# EAGLE board DeMuxRow2 (EAGLE 6.6.0)
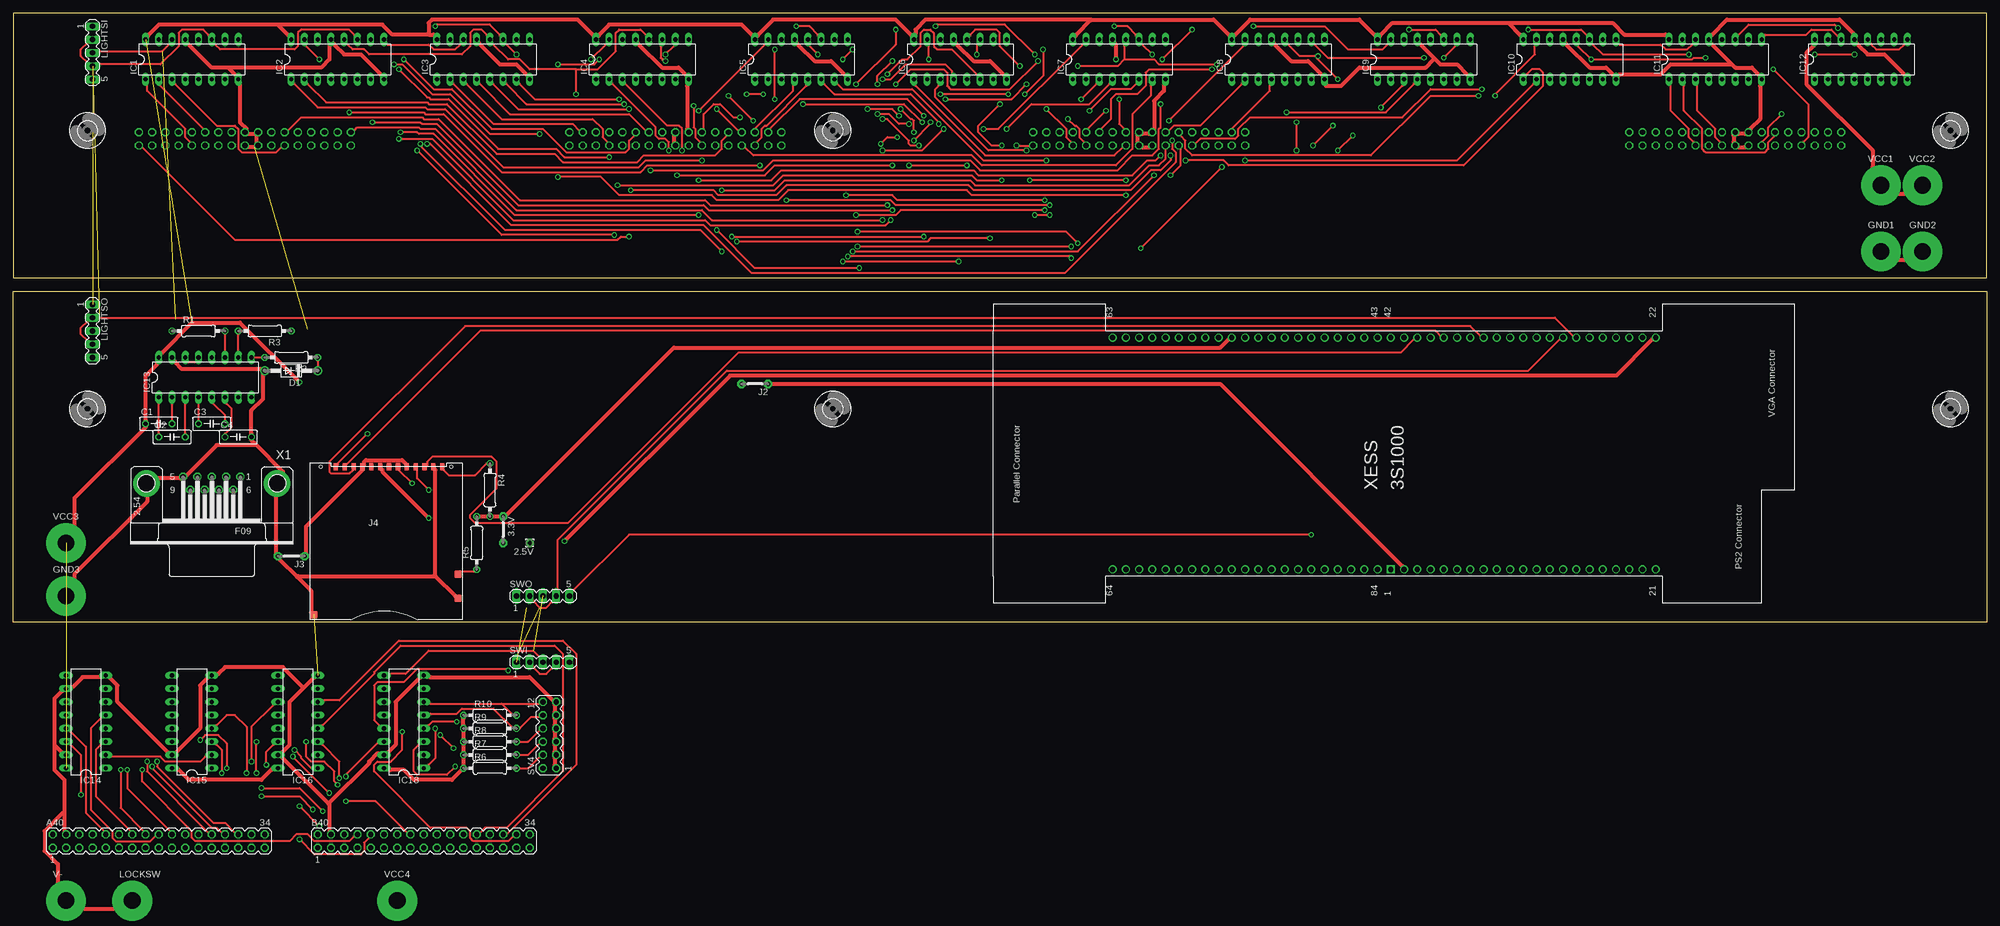
[diagram p2: board, top side]
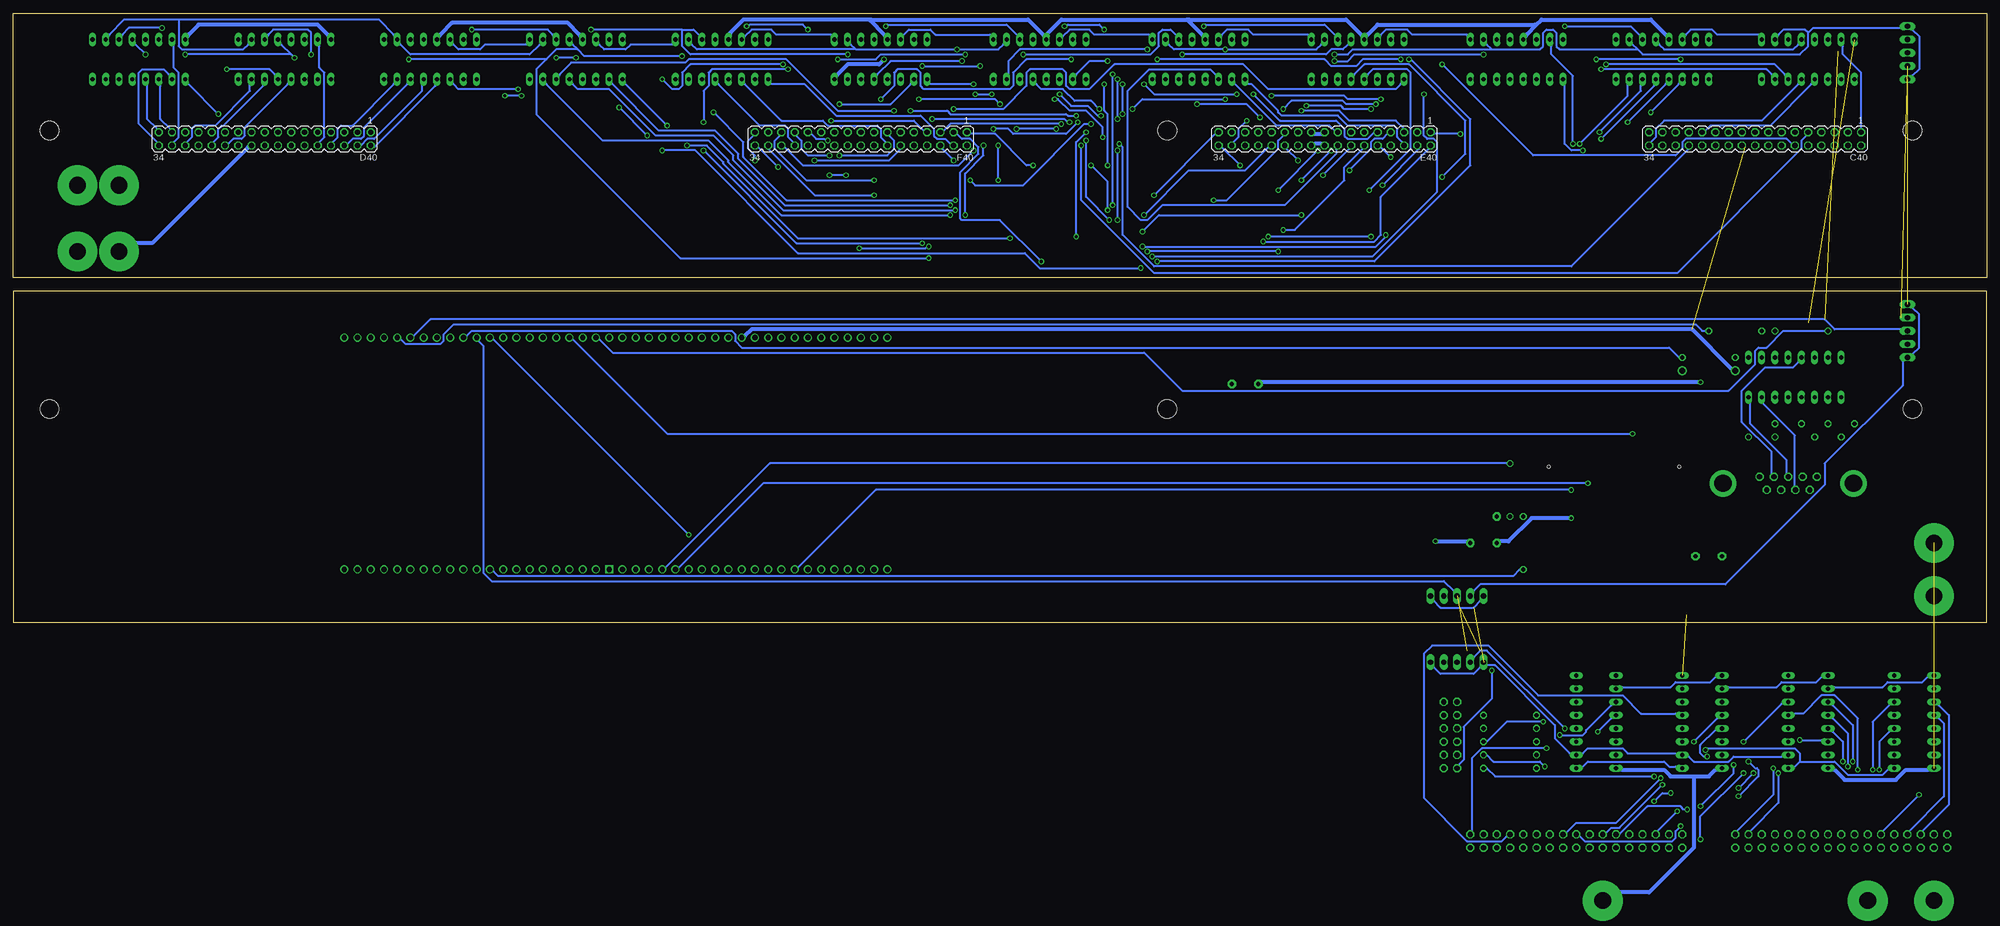
[diagram p3: board, bottom side, seen from below]

Size 378.46 x 116.84 mm. Coordinates in mm from the lower left corner, seen from the top.
Outline: 378.46,66.04 378.46,116.84 0,116.84 0,66.04 378.46,66.04
Outline: 0,63.5 378.46,63.5 378.46,0 0,0 0,63.5
Copper layers (1*16): Top 0.035mm / dielectric 1.5mm / Bottom 0.035mm
Design rules "15mils": minimum track width 15mil, minimum drill 24mil, track to track 15mil, track to pad 10mil, pad to pad 10mil, via to via 10mil, smd to smd 10mil, copper to edge 25mil, drill to drill 10mil, minimum pad ring 10mil, minimum via ring 8mil, stop-mask expansion 0mil, vias tented up to drill 0mil, thermal gap 10mil
Net classes: 1 supply: width 0.762 mm

## Footprints (pad centres in the part's own frame; a part is rotated, then mirrored left to right if it is on the bottom)
1,6/0,8 = drill 0.813 pad 1.6 octagon: 1 0,0
05 = drill 0.813 pad 1.6 octagon: 1 -2.54,0; 2 2.54,0
MA17-2 = drill 1.016 octagon: 1 -20.32,-1.27; 2 -20.32,1.27; 3 -17.78,-1.27; 4 -17.78,1.27; 5 -15.24,-1.27; 6 -15.24,1.27; 7 -12.7,-1.27; 8 -12.7,1.27; 9 -10.16,-1.27; 10 -10.16,1.27; 11 -7.62,-1.27; 12 -7.62,1.27; 13 -5.08,-1.27; 14 -5.08,1.27; 15 -2.54,-1.27; 16 -2.54,1.27; 17 0,-1.27; 18 0,1.27; 19 2.54,-1.27; 20 2.54,1.27; 21 5.08,-1.27; 22 5.08,1.27; 23 7.62,-1.27; 24 7.62,1.27; 25 10.16,-1.27; 26 10.16,1.27; 27 12.7,-1.27; 28 12.7,1.27; 29 15.24,-1.27; 30 15.24,1.27; 31 17.78,-1.27; 32 17.78,1.27; 33 20.32,-1.27; 34 20.32,1.27
C050-025X075 = drill 0.813 octagon: 1 -2.54,0; 2 2.54,0
DO41Z10 = drill 1.118: A 5.08,0; C -5.08,0
SPADELUG = drill 3.175 pad 7.62: 1 0,0
DIL16 = drill 0.813 long: 1 -8.89,-3.81; 2 -6.35,-3.81; 3 -3.81,-3.81; 4 -1.27,-3.81; 5 1.27,-3.81; 6 3.81,-3.81; 7 6.35,-3.81; 8 8.89,-3.81; 9 8.89,3.81; 10 6.35,3.81; 11 3.81,3.81; 12 1.27,3.81; 13 -1.27,3.81; 14 -3.81,3.81; 15 -6.35,3.81; 16 -8.89,3.81
SCDA5A = smd 1 x 1.3: 1 -7.525,-0.65; 2 -5.825,-0.65; 3 -4.125,-0.65; 3A -2.425,-0.65; 4 -0.725,-0.65; 4A 0.975,-0.65; 5 2.675,-0.65; 6 4.375,-0.65; 7 6.075,-0.65; 8 7.775,-0.65; 9 -9.225,-0.65; 10 11.175,-0.65; 11 9.475,-0.65 | smd 1.4 x 1.4: 12 14.2,-21.225; 13 14.2,-25.875; 14 -13.475,-28.975 | hole 0.61: 12.875,-0.6; -12.125,-0.6
MA05-1 = drill 1.016 long: 1 -5.08,0; 2 -2.54,0; 3 0,0; 4 2.54,0; 5 5.08,0
0207/10 = drill 0.813 octagon: 1 -5.08,0; 2 5.08,0
MA06-2 = drill 1.016 octagon: 1 -6.35,-1.27; 2 -6.35,1.27; 3 -3.81,-1.27; 4 -3.81,1.27; 5 -1.27,-1.27; 6 -1.27,1.27; 7 1.27,-1.27; 8 1.27,1.27; 9 3.81,-1.27; 10 3.81,1.27; 11 6.35,-1.27; 12 6.35,1.27
3,6 = hole 3.6: 0,0
F09HP = drill 1.016 octagon: 1 -5.486,-1.27; 2 -2.743,-1.27; 3 0,-1.27; 4 2.743,-1.27; 5 5.486,-1.27; 6 -4.115,1.27; 7 -1.372,1.27; 8 1.372,1.27; 9 4.115,1.27 | drill 3.302 pad 5.08: G1 -12.522,0; G2 12.522,0
3S1000 = drill 1.016 square: 1 0,0 | drill 1.016: 2 0,-2.54; 3 0,-5.08; 4 0,-7.62; 5 0,-10.16; 6 0,-12.7; 7 0,-15.24; 8 0,-17.78; 9 0,-20.32; 10 0,-22.86; 11 0,-25.4; 12 0,-27.94; 13 0,-30.48; 14 0,-33.02; 15 0,-35.56; 16 0,-38.1; 17 0,-40.64; 18 0,-43.18; 19 0,-45.72; 20 0,-48.26; 21 0,-50.8; 22 44.45,-50.8; 23 44.45,-48.26; 24 44.45,-45.72; 25 44.45,-43.18; 26 44.45,-40.64; 27 44.45,-38.1; 28 44.45,-35.56; 29 44.45,-33.02; 30 44.45,-30.48; 31 44.45,-27.94; 32 44.45,-25.4; 33 44.45,-22.86; 34 44.45,-20.32; 35 44.45,-17.78; 36 44.45,-15.24; 37 44.45,-12.7; 38 44.45,-10.16; 39 44.45,-7.62; 40 44.45,-5.08; 41 44.45,-2.54; 42 44.45,0; 43 44.45,2.54; 44 44.45,5.08; 45 44.45,7.62; 46 44.45,10.16; 47 44.45,12.7; 48 44.45,15.24; 49 44.45,17.78; 50 44.45,20.32; 51 44.45,22.86; 52 44.45,25.4; 53 44.45,27.94; 54 44.45,30.48; 55 44.45,33.02; 56 44.45,35.56; 57 44.45,38.1; 58 44.45,40.64; 59 44.45,43.18; 60 44.45,45.72; 61 44.45,48.26; 62 44.45,50.8; 63 44.45,53.34; 64 0,53.34; 65 0,50.8; 66 0,48.26; 67 0,45.72; 68 0,43.18; 69 0,40.64; 70 0,38.1; 71 0,35.56; 72 0,33.02; 73 0,30.48; 74 0,27.94; 75 0,25.4; 76 0,22.86; 77 0,20.32; 78 0,17.78; 79 0,15.24; 80 0,12.7; 81 0,10.16; 82 0,7.62; 83 0,5.08; 84 0,2.54

## Placement (x,y rotation side)
2.5V  [1,6/0,8]  99.06,15.24 180 top
3.3V  J5MM  [05]  93.98,17.78 270 top
A40  [MA17-2]  27.94,-41.91 0 top  (outside the outline)
B40  [MA17-2]  78.74,-41.91 0 top  (outside the outline)
C1  0.1uf  [C050-025X075]  27.94,38.1 0 top
C2  0.1uf  [C050-025X075]  30.48,35.56 0 top
C3  0.1uf  [C050-025X075]  38.1,38.1 0 top
C4  0.1uf  [C050-025X075]  43.18,35.56 0 top
C40  [MA17-2]  44.45,92.71 180 bottom
D1  1N4728  [DO41Z10]  53.34,48.26 180 top
D40  [MA17-2]  330.2,92.71 180 bottom
E40  [MA17-2]  127,92.71 180 bottom
F40  [MA17-2]  215.9,92.71 180 bottom
GND1  LUG  [SPADELUG]  358.14,71.12 0 top
GND2  LUG  [SPADELUG]  366.08,71.12 0 top
GND3  LUG  [SPADELUG]  10.16,5.08 0 top
IC1  74HC595N  [DIL16]  34.29,107.95 0 top
IC2  74HC595N  [DIL16]  62.23,107.95 0 top
IC3  74HC595N  [DIL16]  90.17,107.95 0 top
IC4  74HC595N  [DIL16]  120.65,107.95 0 top
IC5  74HC595N  [DIL16]  151.13,107.95 0 top
IC6  74HC595N  [DIL16]  181.61,107.95 0 top
IC7  74HC595N  [DIL16]  212.09,107.95 0 top
IC8  74HC595N  [DIL16]  242.57,107.95 0 top
IC9  74HC595N  [DIL16]  270.51,107.95 0 top
IC10  74HC595N  [DIL16]  298.45,107.95 0 top
IC11  74HC595N  [DIL16]  326.39,107.95 0 top
IC12  74HC595N  [DIL16]  354.33,107.95 0 top
IC13  MAX232  [DIL16]  36.83,46.99 0 top
IC14  74HC165N  [DIL16]  13.97,-19.05 90 top  (outside the outline)
IC15  74HC165N  [DIL16]  34.29,-19.05 90 top  (outside the outline)
IC16  74HC165N  [DIL16]  54.61,-19.05 90 top  (outside the outline)
IC18  74HC165N  [DIL16]  74.93,-19.05 90 top  (outside the outline)
J2  J5MM  [05]  142.24,45.72 180 top
J3  J5MM  [05]  53.34,12.7 180 top
J4  SDCARD  [SCDA5A]  71.12,30.48 0 top
LIGHTSI  [MA05-1]  15.24,109.22 270 top
LIGHTSO  [MA05-1]  15.24,55.88 270 top
LOCKSW  LUG  [SPADELUG]  22.86,-53.34 0 top  (outside the outline)
R1  330  [0207/10]  35.56,55.88 0 top
R2  330  [0207/10]  53.34,50.8 180 top
R3  330  [0207/10]  48.26,55.88 180 top
R4  330  [0207/10]  91.44,25.4 270 top
R5  330  [0207/10]  88.9,15.24 90 top
R6  330  [0207/10]  91.44,-27.94 0 top  (outside the outline)
R7  330  [0207/10]  91.44,-25.4 0 top  (outside the outline)
R8  330  [0207/10]  91.44,-22.86 0 top  (outside the outline)
R9  330  [0207/10]  91.44,-20.32 0 top  (outside the outline)
R10  330  [0207/10]  91.44,-17.78 0 top  (outside the outline)
SV4  [MA06-2]  102.87,-21.59 90 top  (outside the outline)
SWI  [MA05-1]  101.6,-7.62 0 top  (outside the outline)
SWO  [MA05-1]  101.6,5.08 0 top
U$1  [3,6]  14.29,40.96 0 top
U$2  [3,6]  157.16,40.96 0 top
U$3  [3,6]  371.48,40.96 0 top
U$5  [3,6]  371.48,94.3 0 top
U$9  [3,6]  14.29,94.3 0 top
U$11  [3,6]  157.16,94.3 0 top
V-  LUG  [SPADELUG]  10.16,-53.34 0 top  (outside the outline)
VCC1  LUG  [SPADELUG]  358.14,83.82 0 top
VCC2  LUG  [SPADELUG]  366.08,83.82 0 top
VCC3  LUG  [SPADELUG]  10.16,15.24 0 top
VCC4  LUG  [SPADELUG]  73.66,-53.34 0 top  (outside the outline)
X1  [F09HP]  38.1,26.67 180 top
XESS  3S1000  [3S1000]  264.16,10.16 90 top

## Tracks (layer width: path | path; a pad name or v marks a point on that pad's centre or on a via)
+2V5  (via drill 0.61)
  Top 0.762: v105.73,15.56 137.48,47.31 307.34,47.31 314.32,54.29 XESS.22
  Bottom 0.762: v105.73,15.56 99.69,15.56 2.5V.1
+3V3
  Top 0.762: XESS.54 233.04,54.29 231.46,52.71 126.68,52.71 94.61,20.64 3.3V.1 93.34,20.32 92.08,20.32 R4.2 90.81,20.32 89.53,20.32 R5.2
+5V
  Top 0.762: XESS.2 266.38,10.8 231.46,45.72 145.41,45.72 J2.1
AC0  (via drill 0.61)
  Top 0.381: v220.03,99.38 220.03,94.93 219.71,94.62 219.71,90.81 218.44,89.54 214.63,89.54 211.77,86.68 185.42,86.68 183.51,88.58 145.73,88.58 143.83,86.68 v122.24,86.68
  Bottom 0.381: v220.03,99.38 210.19,99.38 206.38,103.19 IC7.2 | v122.24,86.68 118.11,90.81 118.11,92.08 117.47,92.71 115.89,92.71 114.94,93.66 E40.7
AC1  (via drill 0.61)
  Top 0.381: v204.79,100.33 207.65,103.19 IC7.3 | v189.23,99.38 185.1,95.25 185.1,93.98 187.64,91.44 v189.55,91.44 | v189.55,84.77 184.78,84.77 183.83,85.73 147.64,85.73 145.73,83.82 v115.89,83.82
  Bottom 0.381: v204.79,100.33 190.18,100.33 v189.23,99.38 | v189.55,84.77 v189.55,91.44 | v115.89,83.82 108.9,90.81 E40.4
AC2  (via drill 0.61)
  Top 0.381: v190.5,94.62 195.26,99.38 206.38,99.38 210.19,103.19 IC7.4 | v174.31,95.89 170.81,99.38 v151.45,99.38 | v139.38,96.84 138.11,96.84 135.57,99.38 134.3,99.38 132.4,97.47 132.4,94.62 E40.21
  Bottom 0.381: v190.5,94.62 187.64,94.62 186.69,93.66 176.53,93.66 v174.31,95.89 | v151.45,99.38 141.92,99.38 v139.38,96.84
AC3  (via drill 0.61)
  Top 0.381: v196.53,107.63 191.13,102.24 179.71,102.24 179.07,102.87 179.07,105.41 178.44,106.05 172.09,106.05 v169.23,103.19 | v168.59,87.63 146.05,87.63 144.15,85.73 v127.32,85.73
  Bottom 0.381: v196.53,107.63 210.19,107.63 212.72,105.09 IC7.5 | v169.23,103.19 169.23,98.11 168.59,97.47 v168.59,87.63 | v127.32,85.73 122.24,90.81 E40.14
AC4  (via drill 0.61)
  Top 0.381: v206.38,98.11 210.5,102.24 214.31,102.24 215.26,103.19 IC7.6 | v174.62,97.16 171.45,100.33 150.81,100.33 145.1,94.62 E40.31
  Bottom 0.381: v206.38,98.11 199.39,98.11 198.75,97.47 176.53,97.47 176.21,97.16 v174.62,97.16
AC5
  Top 0.381: IC7.7 218.12,102.87 218.12,100.97 214.63,97.47 214.63,90.81 211.46,87.63 185.74,87.63 183.83,89.54 141.92,89.54 140.34,91.12 E40.28
AC6  (via drill 0.61)
  Top 0.381: v221.62,96.2 235.9,110.49 IC8.15
  Bottom 0.381: v221.62,96.2 205.74,96.2 203.84,94.3 F40.7
AC7
  Bottom 0.381: IC8.1 233.04,103.19 226.69,103.19 220.66,97.16 204.47,97.16 201.93,94.62 201.93,93.34 201.29,92.71 199.71,92.71 198.75,91.76 F40.4
AC8
  Top 0.381: IC8.2 235.59,103.19 227.65,95.25 222.57,95.25 221.62,94.3 F40.21
AC9
  Bottom 0.381: IC8.3 238.12,103.19 231.14,96.2 223.2,96.2 222.25,95.25 212.72,95.25 212.09,94.62 212.09,93.03 211.14,92.08 F40.14
AC10
  Top 0.381: IC8.4 240.98,102.87 240.98,101.92 233.68,94.62 F40.31
AC11
  Bottom 0.381: IC8.5 243.21,103.19 235.27,95.25 230.5,95.25 229.87,94.62 229.87,93.03 228.92,92.08 F40.28
AND
  Bottom 0.381: IC10.4 297.5,102.87 309.25,91.12 D40.2
BREAK  (via drill 0.61)
  Top 0.381: v339.09,97.47 336.55,94.93 336.55,93.34 335.28,92.08 D40.22
  Bottom 0.381: v339.09,97.47 344.81,103.19 IC12.1
CA
  Bottom 0.381: IC12.15 347.66,110.49 347.66,106.36 346.71,105.41 346.71,93.03 347.66,92.08 D40.32
CF1  (via drill 0.61)
  Top 0.381: v94.93,-9.21 94.61,-8.89 77.47,-8.89 74.93,-11.43 69.85,-11.43 69.22,-12.06 69.22,-18.73 70.17,-19.68 IC18.13
  Bottom 0.381: v94.93,-9.21 94.93,-14.6 100.33,-20 100.33,-26.35 101.28,-27.3 SV4.2
CF2  (via drill 0.61)
  Top 0.381: R6.2 97.16,-27.94 98.74,-27.94 100.97,-25.72 SV4.4 | v63.82,-29.53 63.82,-29.21 69.85,-23.18 IC18.14
  Bottom 0.381: v63.82,-29.53 94.3,-29.53 95.89,-27.94 R6.2
CF3  (via drill 0.61)
  Top 0.381: R7.2 97.16,-25.4 98.74,-25.4 100.97,-23.18 SV4.6 | v84.77,-27.62 83.19,-29.21 77.47,-29.21 76.83,-28.57 76.83,-24.45 77.79,-23.49 IC18.3
  Bottom 0.381: v84.77,-27.62 85.72,-26.67 94.61,-26.67 95.89,-25.4 R7.2
CF4  (via drill 0.61)
  Top 0.381: R8.2 97.16,-22.86 98.74,-22.86 100.97,-20.64 SV4.8 | v85.09,-19.05 80.33,-19.05 79.69,-19.68 IC18.4
  Bottom 0.381: v85.09,-19.05 92.08,-19.05 95.89,-22.86 R8.2
CF5
  Top 0.381: IC18.5 80.01,-17.46 85.09,-17.46 86.04,-16.51 92.08,-16.51 95.89,-20.32 R9.2 97.16,-20.32 99.38,-18.1 100.97,-18.1 SV4.10
CF6
  Top 0.381: 93.66,-15.56 80.01,-15.56 IC18.6 | 93.66,-15.56 95.89,-17.78 R10.2 | 93.66,-15.56 100.97,-15.56 SV4.12
CONT
  Bottom 0.381: IC16.5 59.69,-17.46 66.36,-17.46 69.85,-13.97 86.04,-13.97 95.57,-4.44 106.36,-4.44 107.95,-6.03 107.95,-33.65 99.69,-41.91 93.03,-41.91 92.08,-40.96 B40.28
DCA
  Bottom 0.381: IC10.7 305.44,103.19 313.37,95.25 315.6,95.25 316.23,94.62 316.23,93.03 317.18,92.08 D40.8
DEFER
  Bottom 0.381: IC11.6 330.52,102.87 338.14,95.25 338.45,95.25 339.09,94.62 339.09,93.03 340.04,92.08 D40.26
DEP  (via drill 0.61)
  Top 0.381: v62.55,-29.84 62.55,-26.67 59.37,-23.49 IC16.3
  Bottom 0.381: v62.55,-29.84 71.12,-38.42 78.74,-38.42 80.64,-40.32 B40.20
DF0
  Bottom 0.381: IC1.15 27.62,110.49 27.62,108.9 24.13,105.41 24.13,94.62 C40.1
DF1
  Top 0.381: IC1.1 25.72,102.87 25.72,101.92 33.02,94.62 33.02,93.03 33.97,92.08 C40.10
DF2
  Top 0.381: IC1.2 28.26,102.87 36.51,94.62 C40.11
EXAM
  Top 0.381: IC16.4 59.37,-19.68 69.22,-9.84 69.22,-9.52 74.3,-4.44 103.82,-4.44 105.41,-6.03 105.41,-28.57 94.61,-39.37 90.49,-39.37 89.53,-40.32 B40.26
EXECUTE  (via drill 0.61)
  Top 0.381: v337.5,106.05 344.17,99.38 344.17,93.03 343.22,92.08 D40.28
  Bottom 0.381: v337.5,106.05 329.25,106.05 328.3,105.09 IC11.5
FETCH
  Bottom 0.381: IC11.4 325.75,103.19 334.01,94.93 334.01,93.34 334.64,92.71 336.23,92.71 337.19,91.76 D40.24
GND  (via drill 0.61)  (2 unrouted)
  Top 0.762: GND1.1 361.63,69.53 362.58,69.53 GND2.1 | IC10.13 297.81,110.81 302.26,106.36 305.44,106.36 306.7,105.09 IC10.8 307.98,105.09 315.91,105.09 317.82,107 329.25,107 329.41,107.16 | IC12.8 362.58,105.09 358.77,108.9 355.6,108.9 353.69,110.81 IC12.13 352.74,113.03 350.2,115.57 328.61,115.57 325.75,112.71 IC11.13 325.75,110.81 329.41,107.16 | D40.20 332.11,91.12 330.83,91.12 D40.18 329.88,92.08 329.88,93.34 D40.17 330.83,93.66 332.11,93.66 D40.19 333.06,94.62 334.96,96.52 334.96,102.87 IC11.8 334.64,105.09 333.38,106.36 330.2,106.36 329.41,107.16 | E40.17 126.68,93.34 126.68,92.08 E40.18 | E40.19 129.22,94.62 129.22,102.87 IC4.8 128.91,105.09 127.64,106.36 124.46,106.36 120.02,110.81 IC4.13 | IC3.8 98.42,105.09 96.52,107 93.34,107 89.53,110.81 IC3.13 | IC2.8 70.48,105.09 66.67,108.9 63.5,108.9 61.59,110.81 IC2.13 60.64,110.49 60.64,107.95 59.05,106.36 41.59,106.36 41.27,106.36 | C40.18 45.09,91.12 46.35,91.12 C40.20 46.67,92.08 46.67,93.34 C40.19 46.35,93.66 45.09,93.66 C40.17 44.77,94.62 43.5,95.89 43.5,102.87 IC1.8 42.55,105.09 41.27,106.36 | 41.27,106.36 38.1,106.36 33.66,110.81 IC1.13 | IC5.8 159.38,105.09 156.84,107.63 153.67,107.63 150.5,110.81 IC5.13 | IC6.8 189.87,105.09 187.32,107.63 184.15,107.63 180.97,110.81 IC6.13 | F40.20 217.81,91.12 216.53,91.12 F40.18 215.58,92.08 215.58,93.34 F40.17 216.53,93.66 217.81,93.66 F40.19 218.76,94.62 218.76,100.01 220.66,101.92 220.66,102.87 IC7.8 | 272.57,108.11 269.88,110.81 IC9.13 | 272.57,108.11 273.69,107 276.86,107 278.76,105.09 IC9.8 | IC8.13 241.94,110.81 245.11,107.63 248.28,107.63 250.82,105.09 IC8.8 251.78,102.87 254.63,102.87 258.13,106.36 270.83,106.36 272.42,107.95 272.57,108.11
  Top 0.762: v211.46,107.95 211.46,110.81 IC7.13 | 46.51,34.13 51.75,28.89 X1.G1 50.48,24.45 50.48,13.34 J3.2 51.12,12.07 54.45,8.73 | 46.51,34.13 45.72,34.93 C4.2 45.72,36.2 45.72,40.64 47.94,42.86 47.94,47.63 D1.A 47.62,48.58 32.38,48.58 31.11,49.85 IC13.15 | 46.51,34.13 46.35,33.97 39.05,33.97 33.34,28.26 X1.5 32.07,27.62 27.94,27.62 X1.G2 25.72,23.18 11.75,9.21 11.75,8.57 GND3.1 | 80.96,8.89 80.96,29.21 J4.11 | 80.96,8.89 84.77,5.08 J4.13 | 54.45,8.73 57.15,6.03 57.15,1.91 J4.14 | 80.96,8.89 80.64,8.89 54.61,8.89 54.45,8.73 | 60.48,-34.77 60.64,-34.92 60.64,-40 B40.4 | 60.48,-34.77 51.75,-26.03 IC16.15 51.75,-24.77 53.02,-23.49 53.02,-15.24 55.72,-12.54 | 55.72,-12.54 57.47,-10.79 IC16.8 | SV4.1 103.82,-27.3 103.82,-26.03 SV4.3 103.82,-24.77 103.82,-23.49 SV4.5 103.82,-22.22 103.82,-20.95 SV4.7 103.82,-19.68 103.82,-18.41 SV4.9 103.82,-17.14 103.82,-15.88 SV4.11 103.5,-14.92 99.06,-10.48 80.01,-10.48 IC18.8 77.79,-10.79 73.34,-15.24 73.34,-23.49 72.07,-24.77 IC18.15 69.85,-25.08 68.26,-26.67 68.26,-26.99 60.64,-34.61 60.48,-34.77 | LOCKSW.1 19.37,-54.93 13.65,-54.93 V-.1 8.57,-49.85 8.57,-46.35 6.03,-43.81 6.03,-40 9.53,-36.51 9.84,-36.51 | 8.1,-23.65 7.94,-23.49 7.94,-14.6 9.21,-13.33 IC14.10 11.43,-12.38 13.34,-10.48 16.51,-10.48 IC14.8 18.73,-10.79 20,-12.06 20,-15.24 29.53,-24.77 IC15.15 31.43,-24.77 35.88,-20.32 35.88,-12.06 37.15,-10.79 IC15.8 39.37,-9.84 40.64,-8.57 51.75,-8.57 55.56,-12.38 55.72,-12.54 | 8.1,-23.65 9.21,-24.77 IC14.15 | 9.84,-36.51 9.84,-30.16 7.94,-28.26 7.94,-23.81 8.1,-23.65 | 9.84,-36.51 9.84,-40 A40.4
  Bottom 0.762: GND1.1 354.65,72.71 351.79,72.71 333.38,91.12 D40.20 | E40.18 127.64,91.76 128.91,91.76 E40.20 | E40.17 127.64,93.66 128.91,93.66 E40.19 | 86.52,114.46 85.41,115.57 64.45,115.57 61.59,112.71 IC2.13 | 86.52,114.46 88.27,112.71 IC3.13 | 86.52,114.46 86.68,114.62 116.84,114.62 118.75,112.71 IC4.13 120.02,112.71 122.87,115.57 153.03,115.57 153.19,115.41 | 153.19,115.41 153.35,115.57 177.48,115.57 180.02,113.03 IC6.13 180.97,112.71 183.83,115.57 214,115.57 214.15,115.41 | 153.19,115.41 150.5,112.71 IC5.13 | 214.15,115.41 214.31,115.57 238.44,115.57 240.98,113.03 IC8.13 | 214.15,115.41 211.46,112.71 IC7.13 | v211.46,107.95 212.41,107 218.44,107 220.34,105.09 IC7.8 | IC10.13 296.55,112.71 294.32,114.94 272.1,114.94 269.88,112.71 IC9.13 | XESS.52 238.12,54.93 236.85,56.2 56.52,56.2 48.9,48.58 D1.A
IF0
  Top 0.381: IC1.3 31.11,103.19 39.05,95.25 42.55,95.25 43.18,94.62 43.18,90.81 43.81,90.17 50.48,90.17 51.44,91.12 C40.24
IF1
  Bottom 0.381: IC1.4 33.66,103.19 41.59,95.25 53.02,95.25 53.98,94.3 C40.25
IF2
  Bottom 0.381: IC1.5 36.2,103.19 43.18,96.2 61.91,96.2 63.5,94.62 63.5,93.03 64.45,92.08 C40.34
ION
  Bottom 0.381: IC12.2 348.62,105.09 349.57,106.05 353.69,106.05 354.33,105.41 354.33,95.57 350.84,92.08 D40.34
IOT
  Top 0.381: IC11.2 320.36,102.87 320.36,98.11 323.85,94.62 323.85,90.81 324.49,90.17 335.92,90.17 336.55,90.81 336.55,92.08 337.82,93.34 D40.23
ISZ
  Bottom 0.381: IC10.6 302.89,103.19 311.15,94.93 311.15,93.34 311.79,92.71 313.37,92.71 314.32,91.76 D40.6
JMP
  Top 0.381: IC11.1 317.82,102.87 317.82,98.11 321.31,94.62 321.31,93.03 322.26,92.08 D40.12
JMS
  Bottom 0.381: IC11.15 319.72,110.49 319.72,106.36 318.77,105.41 318.77,93.03 319.72,92.08 D40.10
LA  (via drill 0.61)
  Top 0.381: v48.58,-27.3 48.58,-24.77 49.85,-23.49 IC16.14 | v58.74,-39.05 v54.93,-35.24
  Bottom 0.381: v48.58,-27.3 48.58,-28.89 v54.93,-35.24 | v58.74,-39.05 59.69,-40 59.69,-41.27 60.33,-41.91 77.15,-41.91 78.11,-40.96 B40.18
LINK  (via drill 0.61)
  Top 0.381: v194.31,103.19 191.45,100.33 v178.75,100.33 | v169.54,93.03 167.64,93.03 v166.37,91.76
  Bottom 0.381: v194.31,103.19 202.56,103.19 IC7.1 | v178.75,100.33 178.12,100.33 175.9,98.11 172.72,98.11 169.54,94.93 v169.54,93.03 | v166.37,91.76 165.74,91.12 165.74,74.3 159.7,68.26 79.69,68.26 57.15,90.81 C40.28
MA0
  Top 0.381: IC3.2 84.45,103.19 92.08,95.57 107.31,95.57 108.58,94.3 E40.3
MA1
  Top 0.381: IC3.3 87,103.19 93.66,96.52 111.12,96.52 113.03,94.62 113.03,93.03 113.98,92.08 E40.8
MA2
  Top 0.381: IC3.4 89.53,103.19 95.25,97.47 118.11,97.47 121.28,94.3 E40.13
MA3  (via drill 0.61)
  Top 0.381: v118.11,98.43 96.84,98.43 92.08,103.19 IC3.5 | v130.49,99.06 130.49,94.93 130.81,94.62 130.81,93.03 131.76,92.08 E40.22
  Bottom 0.381: v118.11,98.43 123.19,98.43 123.83,99.06 v130.49,99.06
MA4  (via drill 0.61)
  Top 0.381: v117.16,99.38 98.42,99.38 94.61,103.19 IC3.6 | v134.94,98.43 139.06,94.3 E40.27
  Bottom 0.381: v117.16,99.38 122.87,99.38 123.51,100.01 133.35,100.01 v134.94,98.43
MA5  (via drill 0.61)
  Top 0.381: v116.2,100.33 100.01,100.33 97.16,103.19 IC3.7 | v137.16,100.97 v141.92,96.2
  Bottom 0.381: v116.2,100.33 122.56,100.33 123.19,100.97 v137.16,100.97 | v141.92,96.2 143.51,94.62 143.51,93.03 144.46,92.08 E40.32
MA6  (via drill 0.61)
  Top 0.381: v110.81,107.95 113.67,110.81 IC4.15 | v159.07,69.22 v181.29,69.22
  Bottom 0.381: v110.81,107.95 110.49,107.95 99.06,96.52 99.06,87.63 117.47,69.22 v159.07,69.22 | v181.29,69.22 189.23,77.15 196.53,77.15 196.85,77.47 196.85,86.36 193.36,89.85 193.36,91.12 194.94,92.71 196.53,92.71 197.49,93.66 F40.3
MA7  (via drill 0.61)
  Top 0.381: v198.12,98.43 201.93,94.62 201.93,93.03 202.88,92.08 F40.8
  Bottom 0.381: v198.12,98.43 188.59,98.43 184.15,102.87 184.15,105.41 183.51,106.05 177.16,106.05 176.53,105.41 176.53,102.87 175.9,102.24 172.09,102.24 167.32,107 142.56,107 137.79,102.24 113.35,102.24 112.39,103.19 IC4.1
MA8  (via drill 0.61)
  Top 0.381: v125.73,90.49 125.73,92.08 125.09,92.71 123.83,92.71 123.19,93.34 123.19,94.93 114.94,103.19 IC4.2 | v131.44,84.77 145.41,84.77 147.32,86.68 184.15,86.68 185.1,85.73 214.63,85.73 217.49,88.58 219.07,88.58 v220.03,89.54
  Bottom 0.381: v131.44,84.77 v125.73,90.49 | v220.03,89.54 210.82,89.54 209.55,90.81 209.55,92.39 210.5,93.34 F40.13
MA9  (via drill 0.61)
  Top 0.381: v128.27,90.49 128.27,94.62 127.64,95.25 125.41,95.25 117.47,103.19 IC4.3 | v135.89,82.87 146.05,82.87 147.96,84.77 183.51,84.77 184.47,83.82 214,83.82 217.81,87.63 219.71,87.63 220.98,88.9 220.98,90.81 F40.22
  Bottom 0.381: v135.89,82.87 v128.27,90.49
MA10  (via drill 0.61)
  Top 0.381: v118.43,82.87 134.3,82.87 135.25,81.92 146.37,81.92 148.27,83.82 183.2,83.82 184.15,82.87 214.31,82.87 218.12,86.68 220.03,86.68 221.93,88.58 v221.93,89.54
  Bottom 0.381: v118.43,82.87 110.49,90.81 110.49,105.41 111.12,106.05 117.79,106.05 118.75,105.09 IC4.4 | v221.93,89.54 226.06,89.54 227.33,90.81 227.33,92.39 228.28,93.34 F40.27
MA11  (via drill 0.61)
  Top 0.381: v104.46,85.41 112.71,85.41 116.2,81.92 133.99,81.92 134.94,80.96 146.69,80.96 148.59,82.87 182.88,82.87 183.83,81.92 v213.36,81.92
  Bottom 0.381: v104.46,85.41 100.01,89.85 100.01,96.2 110.81,107 119.38,107 121.28,105.09 IC4.5 | v213.36,81.92 224.79,81.92 233.68,90.81 F40.32
MB0  (via drill 0.61)
  Top 0.381: v131.44,98.11 144.15,110.81 IC5.15
  Bottom 0.381: v131.44,98.11 124.14,98.11 122.24,96.2 113.35,96.2 111.76,94.62 E40.5
MB1
  Bottom 0.381: IC5.1 141.6,103.19 140.97,103.19 135.89,98.11 135.89,97.79 135.25,97.16 124.46,97.16 122.56,95.25 113.67,95.25 113.03,94.62 113.03,93.03 112.08,92.08 E40.6
MB2
  Bottom 0.381: IC5.2 144.15,103.19 136.21,95.25 126.05,95.25 125.09,94.3 E40.15
MB3
  Bottom 0.381: IC5.3 147.96,105.09 148.91,106.05 160.66,106.05 164.78,101.92 164.78,79.69 162.24,77.15 160.97,77.15 158.12,80.01 134.62,80.01 124.78,89.85 124.78,90.81 E40.16
MB4
  Top 0.381: IC5.4 149.54,102.87 149.54,101.92 142.24,94.62 E40.29
MB5
  Top 0.381: IC5.5 152.08,102.87 144.46,95.25 144.15,95.25 143.51,94.62 143.51,93.03 142.56,92.08 E40.30
MB6  (via drill 0.61)
  Top 0.381: v177.48,95.57 177.48,95.89 172.09,101.28 157.48,101.28 155.57,103.19 IC5.6
  Bottom 0.381: v177.48,95.57 198.75,95.57 200.03,94.3 F40.5
MB7  (via drill 0.61)
  Top 0.381: v198.12,88.58 186.06,88.58 172.4,102.24 159.07,102.24 158.12,103.19 IC5.7
  Bottom 0.381: v198.12,88.58 200.34,90.81 F40.6
MB8  (via drill 0.61)
  Top 0.381: v175.58,107.95 175.58,110.49 IC6.15 | v212.09,100.33 212.09,95.57 213.04,94.62 F40.15
  Bottom 0.381: v175.58,107.95 184.15,107.95 186.69,105.41 186.69,102.87 187.32,102.24 203.84,102.24 204.47,102.87 204.47,105.41 205.1,106.05 208.91,106.05 209.55,105.41 209.55,102.87 v212.09,100.33
MB9
  Top 0.381: IC6.1 173.04,102.87 186.37,89.54 211.14,89.54 212.72,91.12 F40.16
MB10  (via drill 0.61)
  Top 0.381: v168.59,107.63 165.74,104.78 v165.74,103.19 | v165.74,97.47 167.96,97.47 169.86,95.57 v171.77,95.57 | v213.36,84.77 v194.94,84.77
  Bottom 0.381: v168.59,107.63 172.09,107.63 174.62,105.09 IC6.2 | v165.74,97.47 v165.74,103.19 | v171.77,95.57 173.04,95.57 184.78,83.82 193.99,83.82 v194.94,84.77 | v213.36,84.77 226.38,84.77 232.41,90.81 232.41,92.39 231.46,93.34 F40.29
MB11  (via drill 0.61)
  Top 0.381: v194.31,90.49 187.01,90.49 176.85,100.65 176.85,102.24 177.48,102.87 IC6.3
  Bottom 0.381: v194.31,90.49 197.17,87.63 227.01,87.63 230.5,91.12 F40.30
MQ0  (via drill 0.61)
  Top 0.381: v237.81,114.3 251.46,114.3 255.91,109.86 262.57,109.86 263.52,110.81 IC9.15 | v220.34,107.95 v226.06,113.67 | v195.9,108.9 190.18,114.62 177.16,114.62 v176.85,114.3 | v169.23,113.67 169.23,110.81 v161.61,103.19 | v143.83,101.28 v140.65,101.28
  Bottom 0.381: v237.81,114.3 237.49,114.3 237.17,114.62 227.01,114.62 v226.06,113.67 | v220.34,107.95 213.04,107.95 212.09,108.9 v195.9,108.9 | v176.85,114.3 176.53,114.3 176.21,114.62 170.18,114.62 v169.23,113.67 | v161.61,103.19 159.7,101.28 v143.83,101.28 | v140.65,101.28 135.57,96.2 124.78,96.2 123.19,94.62 123.19,93.34 122.56,92.71 118.75,92.71 117.47,93.98 E40.9
MQ1  (via drill 0.61)
  Top 0.381: v249.24,91.44 v253.05,95.25 | v187.32,73.66 175.9,73.66 175.26,73.03 v138.75,73.03
  Bottom 0.381: v253.05,95.25 260.99,103.19 IC9.1 | v249.24,91.44 245.43,91.44 242.25,88.27 242.25,87.95 227.97,73.66 v187.32,73.66 | v138.75,73.03 117.47,73.03 116.2,74.3 116.2,81.6 107,90.81 E40.2
MQ2  (via drill 0.61)
  Top 0.381: v198.75,80.01 169.23,80.01 168.28,80.96 v148.27,80.96
  Bottom 0.381: v198.75,80.01 230.5,80.01 239.4,88.9 239.4,89.85 243.84,94.3 254.63,94.3 263.52,103.19 IC9.2 | v148.27,80.96 145.73,80.96 135.89,90.81 135.89,92.39 134.94,93.34 E40.23
MQ3  (via drill 0.61)
  Top 0.381: v262.25,98.74 266.38,102.87 IC9.3 | v254,90.49 v256.86,93.34 | v162.24,67.95 142.24,67.95 v134.94,75.25
  Bottom 0.381: v256.86,93.34 v262.25,98.74 | v254,90.49 247.65,90.49 227.97,70.8 184.47,70.8 181.61,67.95 v162.24,67.95 | v134.94,75.25 132.72,75.25 123.19,84.77 123.19,87.31 119.7,90.81 E40.12
MQ4  (via drill 0.61)
  Top 0.381: v244.16,97.79 263.21,97.79 268.61,103.19 IC9.4 | v197.8,80.96 169.54,80.96 168.59,81.92 v159.7,81.92
  Bottom 0.381: v244.16,97.79 238.44,92.08 238.44,89.22 230.19,80.96 v197.8,80.96 | v159.7,81.92 147.96,93.66 E40.33
MQ5  (via drill 0.61)
  Top 0.381: v197.8,79.06 170.18,79.06 169.23,78.11 v161.61,78.11
  Bottom 0.381: v197.8,79.06 230.82,79.06 240.35,88.58 240.35,89.54 244.16,93.34 255.27,93.34 264.16,102.24 270.19,102.24 271.14,103.19 IC9.5 | v161.61,78.11 153.03,86.68 142.24,86.68 137.79,91.12 E40.26
MQ6  (via drill 0.61)
  Top 0.381: v209.55,98.11 206.06,94.62 F40.9
  Bottom 0.381: v209.55,98.11 220.34,98.11 230.19,107.95 248.92,107.95 249.56,107.31 271.46,107.31 273.69,105.09 IC9.6
MQ7  (via drill 0.61)
  Top 0.381: v198.75,78.11 v195.9,78.11 | v192.41,91.44 194.94,91.44 F40.2
  Bottom 0.381: v198.75,78.11 231.14,78.11 241.3,88.27 241.3,88.58 245.11,92.39 265.43,92.39 276.23,103.19 IC9.7 | v195.9,78.11 195.9,86.04 192.41,89.54 v192.41,91.44
MQ8  (via drill 0.61)
  Top 0.381: v284.16,100.97 284.16,101.28 291.78,108.9 291.78,110.49 IC10.15 | v280.99,100.97 271.78,100.97 260.35,89.54 226.06,89.54 224.79,90.81 224.79,92.39 223.84,93.34 F40.23
  Bottom 0.381: v280.99,100.97 v284.16,100.97
MQ9  (via drill 0.61)
  Top 0.381: v224.79,88.58 232.09,88.58 233.04,87.63 278.13,87.63 293.37,102.87 293.37,105.41 292.74,106.05 291.15,106.05 290.19,105.09 IC10.1
  Bottom 0.381: v224.79,88.58 210.5,88.58 208.28,90.81 F40.12
MQ10  (via drill 0.61)
  Top 0.381: v236.22,88.58 276.86,88.58 291.46,103.19 IC10.2
  Bottom 0.381: v236.22,88.58 236.22,89.54 237.49,90.81 237.49,92.39 236.54,93.34 F40.33
MQ11  (via drill 0.61)
  Top 0.381: v281.62,102.24 271.78,102.24 266.38,96.84 237.17,96.84 234.95,94.62 234.95,93.34 234.31,92.71 227.65,92.71 226.69,91.76 F40.26
  Bottom 0.381: v281.62,102.24 293.05,102.24 294,103.19 IC10.3
N$1
  Bottom 0.381: IC15.10 29.21,-12.38 20,-12.38 19.05,-11.43 12.38,-11.43 11.43,-10.48 IC14.9
N$2
  Bottom 0.381: IC16.10 49.53,-12.38 40.32,-12.38 39.37,-11.43 32.7,-11.43 31.75,-10.48 IC15.9
N$3
  Bottom 0.381: IC18.10 69.85,-12.38 60.64,-12.38 59.69,-11.43 53.02,-11.43 52.07,-10.48 IC16.9
N$4
  Bottom 0.381: IC5.9 160.66,112.71 171.13,112.71 172.09,113.67 175.9,113.67 177.16,112.4 IC6.14
N$5
  Top 0.381: IC13.10 43.18,52.07 43.18,55.25 R3.2
N$6
  Top 0.381: IC13.11 40.64,52.07 40.64,55.25 R1.2
N$7
  Top 0.381: IC13.9 46.35,50.8 47.62,50.8 R2.2
N$8
  Top 0.381: C1.2 30.48,38.74 30.48,41.91 IC13.2
N$9
  Top 0.381: C2.2 33.02,36.2 33.02,41.91 IC13.3
N$10
  Bottom 0.381: IC1.9 43.81,112.71 51.75,112.71 52.7,113.67 56.83,113.67 57.78,112.71 IC2.14
N$11
  Top 0.381: IC2.9 71.75,110.81 79.69,110.81 80.64,109.86 84.77,109.86 85.72,110.81 IC3.14
N$12
  Bottom 0.381: IC3.9 99.69,112.71 110.17,112.71 111.12,113.67 115.25,113.67 116.2,112.71 IC4.14
N$13
  Bottom 0.381: IC7.9 221.62,112.71 232.09,112.71 233.04,113.67 236.85,113.67 238.12,112.4 IC8.14
N$14
  Bottom 0.381: IC6.9 191.13,112.71 201.61,112.71 202.56,113.67 206.69,113.67 207.65,112.71 IC7.14
N$15
  Top 0.381: IC11.9 335.92,112.71 343.85,112.71 344.81,113.67 348.62,113.67 349.88,112.4 IC12.14
N$16
  Top 0.381: IC10.9 307.98,110.81 315.91,110.81 316.87,109.86 320.99,109.86 321.94,110.81 IC11.14
N$17
  Top 0.381: C2.1 27.94,36.2 27.94,41.91 IC13.1
N$18
  Top 0.381: C3.1 35.56,38.74 35.56,41.91 IC13.4
N$19
  Bottom 0.381: IC9.9 280.04,110.81 287.97,110.81 288.93,109.86 293.05,109.86 294,110.81 IC10.14
N$20
  Top 0.381: C3.2 40.64,38.74 40.64,39.69 38.42,41.91 IC13.5
N$21
  Bottom 0.381: IC4.9 130.18,112.71 140.65,112.71 141.6,113.67 145.73,113.67 146.69,112.71 IC5.14
N$22
  Bottom 0.381: IC8.9 252.09,110.81 260.03,110.81 260.99,109.86 265.11,109.86 266.06,110.81 IC9.14
N$23
  Top 0.381: C4.1 40.64,36.2 41.91,37.47 41.91,40.96 40.96,41.91 IC13.6
N$24
  Top 0.381: IC13.14 33.66,49.85 34.92,49.85 IC13.13
  Bottom 0.381: X1.2 41.27,28.58 41.27,32.7 46.99,38.42 46.99,44.45 42.55,48.9 37.15,48.9 36.2,49.85 IC13.13
N$25
  Bottom 0.381: IC13.7 42.86,41.91 36.83,35.88 36.83,26.04 X1.8
N$26
  Bottom 0.381: IC13.8 45.4,41.91 45.4,38.1 38.42,31.12 38.42,28.58 X1.3
OPR
  Top 0.381: IC11.3 322.9,102.87 322.9,98.11 326.39,94.62 326.39,93.03 327.34,92.08 D40.16
PAUSE
  Bottom 0.381: IC12.3 350.2,102.87 350.2,96.52 348.3,94.62 D40.31
PB-D0  (via drill 0.61)
  Top 0.381: v79.69,25.4 77.47,27.62 77.47,29.21 J4.7
  Bottom 0.381: v79.69,25.4 213.04,25.4 227.97,10.48 XESS.71
PB-D1
  Top 0.381: J4.8 79.38,30.16 79.38,30.8 80.33,31.75 91.76,31.75 92.71,30.8 92.71,25.72 87.63,20.64 87.63,20 88.58,19.05 106.36,19.05 139.06,51.75 266.06,51.75 268.61,54.29 XESS.40
PB-D2  (via drill 0.61)
  Top 0.381: v67.94,36.2 62.23,30.48 62.23,30.16 J4.9
  Bottom 0.381: v67.94,36.2 253.05,36.2 271.14,54.29 XESS.39
PB-D3
  Top 0.381: J4.1 63.82,30.16 89.53,55.88 272.73,55.88 273.69,54.93 XESS.38
PB-D4
  Top 0.381: J4.2 65.09,29.21 64.45,28.58 60.96,28.58 60.64,28.89 60.64,30.8 86.68,56.83 279.4,56.83 281.31,54.93 XESS.35
PB-D5  (via drill 0.61)
  Top 0.381: v76.52,26.67 73.98,29.21 J4.5
  Bottom 0.381: v76.52,26.67 234.63,26.67 250.82,10.48 XESS.80
PB-D6
  Top 0.381: J4.10 82.55,29.21 83.5,28.26 88.58,28.26 90.81,30.48 R4.1
  Bottom 0.381: XESS.81 253.37,10.48 233.36,30.48 92.08,30.48 R4.1
PB-D7
  Top 0.381: J4.12 85.72,9.84 88.58,9.84 R5.1
  Bottom 0.381: XESS.10 286.38,9.84 285.43,8.89 90.81,8.89 89.53,10.16 R5.1
PB-D8  (1 unrouted)
  Top 0.381: LIGHTSI.3 16.51,109.54 28.57,109.54 29.84,110.81 IC1.14
  Bottom 0.381: LIGHTSO.3 16.51,56.2 29.21,56.2 31.11,58.1 298.45,58.1 301.62,54.93 XESS.27
PB-D9  (via drill 0.61)  (1 unrouted)
  Top 0.381: v349.88,113.98 349.25,114.62 332.74,114.62 330.83,112.71 IC11.11 | v267.65,113.67 272.73,113.67 273.69,112.71 IC9.11 | v290.51,113.67 300.67,113.67 301.62,112.71 IC10.11 302.89,110.81 304.8,108.9 v321.31,108.9 | IC2.11 65.41,112.71 64.45,113.67 55.24,113.67 54.61,113.03 54.61,110.49 53.98,109.86 39.69,109.86 38.73,110.81 IC1.11 37.47,112.71 36.51,113.67 32.38,113.67 31.75,113.03 31.75,110.49 28.26,107 16.51,107 LIGHTSI.4 14.29,107.31 13.02,108.59 13.02,109.86 14.29,111.12 LIGHTSI.2 | v80.96,114.3 81.28,114.62 91.44,114.62 93.34,112.71 IC3.11 94.61,110.81 v96.52,108.9 | v150.18,114.3 152.72,114.3 154.31,112.71 IC5.11 | v211.14,114.3 213.68,114.3 215.26,112.71 IC7.11 216.53,110.81 v218.44,108.9 | v184.78,108.9 184.78,110.81 IC6.11 | v125.09,107.63 124.78,107.63 124.14,108.27 124.14,110.49 IC4.11 | LIGHTSO.4 14.29,53.98 13.02,55.25 13.02,56.52 14.29,57.79 LIGHTSO.2 16.51,58.42 295.59,58.42 299.08,54.93 XESS.28
  Bottom 0.381: v349.88,113.98 356.24,113.98 357.5,112.71 IC12.11 | 250.19,113.67 v267.65,113.67 | 250.19,113.67 247.97,113.67 247.01,112.71 IC8.11 | v290.51,113.67 275.91,113.67 274.95,112.71 IC9.11 | v321.31,108.9 321.31,113.03 321.94,113.67 328.61,113.67 329.56,112.71 IC11.11 | v80.96,114.3 68.26,114.3 66.67,112.71 IC2.11 | v150.18,114.3 149.86,114.62 127,114.62 125.09,112.71 IC4.11 | v211.14,114.3 210.82,114.62 187.96,114.62 186.06,112.71 IC6.11 | v184.78,108.9 160.34,108.9 158.75,110.49 158.75,113.03 158.12,113.67 156.53,113.67 155.57,112.71 IC5.11 | v96.52,108.9 121.28,108.9 122.56,107.63 v125.09,107.63 | 250.19,113.67 250.19,110.49 248.6,108.9 v218.44,108.9
PB-D10  (via drill 0.61)  (2 unrouted)
  Top 0.381: SWO.2 99.69,4.13 100.97,2.86 102.23,2.86 103.5,4.13 SWO.4 104.46,6.35 104.46,15.88 136.84,48.26 290.51,48.26 296.55,54.29 XESS.29 | v125.09,108.9 126.68,110.49 IC4.10 | v270.51,108.27 252.09,108.27 249.56,110.81 IC8.10 | v274.32,108.27 276.54,110.49 IC9.10 | v146.05,100.33 v146.05,109.86 | v163.83,98.43 168.59,98.43 v169.86,97.16 | v190.82,101.28 v177.8,101.28 | v193.99,101.28 197.49,104.78 v197.49,109.86 | SWI.2 99.69,-8.57 100.97,-9.84 102.23,-9.84 103.5,-8.57 SWI.4 | v80.96,-20.32 80.96,-26.03 79.69,-27.3 IC18.1 | v53.98,-24.45 55.24,-25.72 55.24,-26.03 57.15,-27.94 IC16.1
  Bottom 0.381: IC4.10 127.64,110.81 128.59,109.86 v146.05,109.86 155.89,109.86 156.84,110.81 IC5.10 | 34.29,113.03 34.92,113.67 39.05,113.67 40.01,112.71 IC1.10 | 34.29,113.03 34.29,110.49 35.88,108.9 66.04,108.9 66.99,109.86 | 66.99,109.86 67.94,110.81 IC2.10 | 94.93,109.86 95.89,110.81 IC3.10 | 94.93,109.86 85.72,109.86 85.09,110.49 85.09,113.03 84.45,113.67 83.19,113.67 82.55,113.03 82.55,110.49 81.92,109.86 66.99,109.86 | v125.09,108.9 122.56,108.9 121.6,109.86 94.93,109.86 | 216.85,109.86 v197.49,109.86 189.55,109.86 188.59,110.81 IC6.10 | 216.85,109.86 217.81,110.81 IC7.10 | 216.85,109.86 247.33,109.86 248.28,110.81 IC8.10 | 346.71,115.57 308.29,115.57 305.44,112.71 IC10.10 304.17,110.81 302.26,108.9 279.4,108.9 277.5,110.81 IC9.10 | 346.71,115.57 357.19,115.57 360.05,112.71 IC12.10 | v270.51,108.27 v274.32,108.27 | v146.05,100.33 161.93,100.33 v163.83,98.43 | v169.86,97.16 170.5,97.16 172.4,99.06 175.58,99.06 v177.8,101.28 | v193.99,101.28 v190.82,101.28 | LIGHTSO.1 14.29,60.33 13.02,59.06 13.02,52.71 14.29,51.44 LIGHTSO.5 16.19,50.17 16.19,45.4 31.11,30.48 31.11,26.35 50.16,7.3 97.16,7.3 98.42,6.03 SWO.2 | 35.88,-26.67 29.21,-26.67 26.67,-29.21 20,-29.21 19.05,-28.26 IC14.1 | 35.88,-26.67 36.83,-27.62 IC15.1 | IC16.1 59.69,-27.62 60.96,-27.62 61.91,-26.67 76.52,-26.67 77.47,-27.62 IC18.1 | v80.96,-20.32 95.89,-5.4 97.16,-5.4 98.42,-6.67 SWI.2 | 35.88,-26.67 35.88,-25.08 36.83,-24.13 53.66,-24.13 v53.98,-24.45 | 346.71,115.57 346.71,110.49 346.07,109.86 334.33,109.86 333.38,110.81 IC11.10 | LIGHTSI.5 14.29,104.78 13.02,106.05 13.02,112.4 14.29,113.67 LIGHTSI.1 16.51,113.98 33.34,113.98 34.29,113.03
PB-D11  (1 unrouted)
  Top 0.381: IC18.9 72.39,-9.84 75.25,-9.84 79.69,-5.4 99.69,-5.4 100.97,-6.67 SWI.3
  Bottom 0.381: SWO.3 102.23,6.03 104.14,7.94 286.7,7.94 288.29,9.53 288.29,53.02 289.24,53.98 XESS.32
PB-D12  (via drill 0.61)  (1 unrouted)
  Top 0.381: v248.92,16.83 118.11,16.83 107.31,6.03 SWO.5 | IC14.2 19.05,-25.72 28.26,-25.72 29.21,-26.67 35.88,-26.67 36.83,-25.72 IC15.2
  Bottom 0.381: SWO.1 97.16,4.13 98.42,2.86 104.78,2.86 106.05,4.13 SWO.5 | v248.92,16.83 286.38,54.29 XESS.33 | SWI.5 106.05,-8.57 104.78,-9.84 98.42,-9.84 97.16,-8.57 SWI.1 95.89,-8.25 94.3,-8.25 82.87,-19.68 82.87,-22.22 80.01,-25.08 IC18.2 77.47,-25.08 76.52,-24.13 69.85,-24.13 68.9,-25.08 59.69,-25.08 IC16.2 57.15,-25.72 56.2,-26.67 49.53,-26.67 48.58,-25.72 39.37,-25.72 IC15.2
PC0  (via drill 0.61)
  Top 0.381: v73.03,107 74.61,107 80.33,101.28 83.82,101.28 91.44,93.66 v100.97,93.66
  Bottom 0.381: v73.03,107 40.64,107 38.73,105.09 IC1.6 | v100.97,93.66 106.05,93.66 E40.1
PC1  (via drill 0.61)
  Top 0.381: v73.98,106.05 79.38,100.65 79.69,100.65 80.01,100.33 83.5,100.33 93.03,90.81 104.14,90.81 105.73,89.22 v114.3,89.22
  Bottom 0.381: v73.98,106.05 42.23,106.05 41.27,105.09 IC1.7 | v114.3,89.22 116.2,91.12 E40.10
PC2  (via drill 0.61)
  Top 0.381: v58.74,107.95 56.2,110.49 IC2.15 | v74.93,107.95 80.64,102.24 84.14,102.24 91.76,94.62 101.6,94.62 106.05,90.17 117.47,90.17 118.11,90.81 118.11,92.39 119.06,93.34 E40.11
  Bottom 0.381: v58.74,107.95 v74.93,107.95
PC3  (via drill 0.61)
  Top 0.381: v132.08,88.58 121.28,88.58 120.02,87.31 93.98,87.31 82.87,98.43 79.38,98.43 79.06,98.74 58.42,98.74 53.98,103.19 IC2.1
  Bottom 0.381: v132.08,88.58 134.3,90.81 E40.24
PC4
  Top 0.381: IC2.2 56.52,103.19 60.01,99.7 79.38,99.7 79.69,99.38 83.19,99.38 92.71,89.85 103.82,89.85 105.41,88.27 119.7,88.27 120.97,89.54 134.62,89.54 135.89,90.81 135.89,92.39 136.84,93.34 E40.25
PC5  (via drill 0.61)
  Top 0.381: v64.45,97.79 78.74,97.79 79.06,97.47 82.55,97.47 93.66,86.36 120.33,86.36 121.6,87.63 v143.19,87.63
  Bottom 0.381: v64.45,97.79 59.05,103.19 IC2.3 | v143.19,87.63 146.69,91.12 E40.34
PC6  (via drill 0.61)
  Top 0.381: v68.9,95.89 78.11,95.89 78.42,95.57 81.28,95.57 96.84,80.01 132.4,80.01 133.35,79.06 v168.59,79.06 | v171.77,87.63 v182.88,87.63
  Bottom 0.381: v68.9,95.89 61.59,103.19 IC2.4 | v168.59,79.06 168.59,84.46 v171.77,87.63 | v182.88,87.63 184.15,87.63 190.18,93.66 194.94,93.66 F40.1
PC7  (via drill 0.61)
  Top 0.381: v73.98,92.71 80.33,92.71 95.89,77.15 132.72,77.15 133.67,76.2 167.32,76.2 v168.28,77.15 | v172.72,92.39 175.9,95.57 v175.9,95.89 | v202.25,96.52 203.52,95.25 203.84,95.25 204.47,94.62 204.47,93.03 205.42,92.08 F40.10
  Bottom 0.381: v73.98,92.71 63.82,102.87 IC2.5 | v168.28,77.15 172.72,81.6 v172.72,92.39 | v175.9,95.89 176.21,95.89 176.85,96.52 v202.25,96.52
PC8  (via drill 0.61)
  Top 0.381: v74.3,93.98 77.47,93.98 77.79,93.66 80.64,93.66 96.2,78.11 v131.44,78.11 | v161.93,74.93 201.93,74.93 v204.15,72.71 | v246.06,95.89 v246.06,90.49 | v229.87,106.05 217.81,106.05 217.17,105.41 217.17,102.87 215.58,101.28 211.46,101.28 210.5,100.33 210.5,96.52 208.6,94.62 F40.11
  Bottom 0.381: v74.3,93.98 66.36,101.92 66.36,102.87 IC2.6 | v131.44,78.11 158.75,78.11 v161.93,74.93 | v204.15,72.71 228.28,72.71 v246.06,90.49 | v246.06,95.89 246.06,101.92 245.11,102.87 245.11,105.41 244.47,106.05 v229.87,106.05
PC9  (via drill 0.61)
  Top 0.381: v78.11,91.76 78.11,91.44 94.3,75.25 131.76,75.25 v135.89,71.12 | v160.97,71.12 204.15,71.12 v218.76,85.73 | v221.93,85.73 223.84,87.63 223.84,90.81 F40.24
  Bottom 0.381: v78.11,91.76 68.9,100.97 68.9,102.87 IC2.7 | v135.89,71.12 v160.97,71.12 | v218.76,85.73 v221.93,85.73
PC10  (via drill 0.61)
  Top 0.381: v79.38,91.76 80.01,91.76 95.57,76.2 132.4,76.2 141.6,66.99 201.61,66.99 222.88,88.27 222.88,90.17 222.25,90.81 v222.25,92.39
  Bottom 0.381: v79.38,91.76 79.38,104.78 83.5,108.9 83.5,110.49 IC3.15 | v222.25,92.39 222.57,92.39 222.88,92.71 224.47,92.71 225.43,93.66 F40.25
PC11  (via drill 0.61)
  Top 0.381: v77.47,90.49 93.66,74.3 v115.25,74.3 | v202.88,72.07 v161.93,72.07 | v231.78,87.31 v216.22,71.76
  Bottom 0.381: v77.47,90.49 79.69,90.49 80.96,91.76 80.96,102.87 IC3.1 | v115.25,74.3 115.25,73.98 117.16,72.07 v161.93,72.07 | v202.88,72.07 203.2,72.07 203.52,71.76 v216.22,71.76 | v231.78,87.31 235.59,91.12 F40.34
RCK  (via drill 0.61)
  Top 0.381: IC2.12 64.14,110.81 65.09,109.86 67.31,109.86 68.26,108.9 86.04,108.9 87.63,110.49 87.63,113.03 88.27,113.67 89.85,113.67 90.81,112.71 IC3.12 92.08,110.81 94.93,107.95 97.16,107.95 99.06,106.05 107.95,106.05 | 107.95,106.05 112.08,106.05 115.57,109.54 115.57,113.03 116.2,113.67 120.33,113.67 121.28,112.71 IC4.12 | v154.31,108.9 152.72,110.49 IC5.12 | IC12.12 356.24,110.81 357.19,109.86 361.63,109.86 362.58,110.81 IC12.9 | v193.04,106.68 189.23,110.49 189.23,113.03 188.59,113.67 184.47,113.67 183.51,112.71 IC6.12 | v204.15,106.68 211.77,106.68 213.04,107.95 | 213.04,107.95 213.04,110.49 IC7.12 | IC8.12 244.47,110.81 246.7,108.59 v250.19,108.59 249.87,108.27 v254,104.14 | 213.04,107.95 218.76,107.95 219.71,107 v230.82,107 | v107.95,101.28 107.95,106.05 | v160.02,70.17 202.56,70.17 v202.88,69.85 | IC10.12 300.04,110.49 v302.58,107.95 302.89,107.95 321.94,107.95 322.26,108.27 v324.49,108.27 | v345.44,108.9 v353.06,108.9
  Bottom 0.381: IC1.12 36.2,110.81 37.15,109.86 61.91,109.86 62.87,110.81 IC2.12 | v154.31,108.9 126.68,108.9 125.73,109.86 123.51,109.86 122.56,110.81 IC4.12 | v204.15,106.68 v193.04,106.68 | v250.19,108.59 268.92,108.59 270.19,109.86 | 270.19,109.86 271.14,110.81 IC9.12 | 276.23,107.95 274.32,109.86 270.19,109.86 | 276.23,107.95 278.13,106.05 278.13,97.47 250.51,69.85 v202.88,69.85 | v230.82,107 248.6,107 250.19,105.41 250.19,102.87 250.82,102.24 252.09,102.24 v254,104.14 | v107.95,101.28 107.95,93.34 107.31,92.71 106.05,92.71 105.41,92.08 105.41,82.55 117.79,70.17 v160.02,70.17 | 276.23,107.95 v302.58,107.95 | v324.49,108.27 325.12,108.9 | 325.12,108.9 327.02,110.81 IC11.12 | v353.06,108.9 354.96,110.81 IC12.12 | 325.12,108.9 v345.44,108.9
RS232-RD
  Top 0.381: R2.1 58.42,50.17 58.42,48.9 D1.C
  Bottom 0.381: XESS.31 291.46,54.93 290.51,55.88 240.66,55.88 240.03,55.25 240.03,53.98 238.76,52.71 60.96,52.71 59.05,50.8 R2.1
RS232-RTS
  Bottom 0.381: R3.1 53.98,55.88 54.61,55.88 55.88,57.15 294,57.15 295.91,55.25 295.91,53.98 296.55,53.34 303.21,53.34 304.17,54.29 XESS.26
RS232-TD
  Bottom 0.381: R1.1 31.11,55.88 39.05,55.88 42.23,52.71 43.81,52.71 44.45,52.07 44.45,49.53 49.53,44.45 154.31,44.45 161.61,51.75 263.52,51.75 266.06,54.29 XESS.41
RUN
  Bottom 0.381: IC12.4 352.74,102.87 352.74,96.52 350.84,94.62 D40.33
SC0  (via drill 0.61)
  Top 0.381: v166.69,104.14 168.28,104.14 171.13,107 178.75,107 180.02,105.73 180.02,105.41 IC6.4 | v166.69,96.52 167.64,96.52 171.77,92.39 171.77,91.76 172.09,91.44 v173.67,91.44
  Bottom 0.381: v166.69,96.52 v166.69,104.14 | v173.67,91.44 173.67,80.96 159.7,66.99 59.37,66.99 35.56,90.81 35.56,92.39 34.61,93.34 C40.9
SC1  (via drill 0.61)
  Top 0.381: v170.18,98.43 172.09,96.52 172.4,96.52 172.72,96.2 v172.72,93.98 | v137.79,73.98 v174.62,73.98 | v118.11,73.98 116.52,73.98 115.89,73.34 42.55,73.34 24.77,91.12 C40.2
  Bottom 0.381: v170.18,98.43 171.77,100.01 174.94,100.01 177.16,102.24 181.29,102.24 182.25,103.19 IC6.5 | v172.72,93.98 174.62,92.08 v174.62,73.98 | v118.11,73.98 v137.79,73.98
SC2  (via drill 0.61)
  Top 0.381: v167.64,105.09 170.5,107.95 171.45,107.95 173.99,110.49 173.99,113.03 174.62,113.67 175.9,113.67 176.53,113.03 176.53,110.49 177.16,109.86 180.02,109.86 184.78,105.09 IC6.6 | v167.64,80.01 133.67,80.01 132.72,80.96 97.16,80.96 81.6,96.52 78.74,96.52 78.42,96.84 55.24,96.84 52.7,94.3 C40.23
  Bottom 0.381: v167.64,80.01 v167.64,105.09
SC3  (via drill 0.61)
  Top 0.381: v159.07,107.95 v160.97,109.86 | v112.39,107.95 111.44,107 v104.46,107
  Bottom 0.381: v160.97,109.86 185.42,109.86 187.64,107.63 187.64,105.41 IC6.7 | v159.07,107.95 127,107.95 125.73,106.68 120.97,106.68 119.7,107.95 v112.39,107.95 | v104.46,107 87,89.54 59.69,89.54 58.42,90.81 58.42,92.08 57.78,92.71 38.42,92.71 37.47,91.76 C40.12
SC4  (via drill 0.61)
  Top 0.381: v186.06,94.62 188.91,94.62 205.1,110.81 IC7.15 | v178.44,94.62 174.31,90.49 v166.69,90.49 | v166.69,77.15 133.99,77.15 132.08,79.06 96.52,79.06 80.96,94.62 78.11,94.62 77.79,94.93 66.04,94.93 65.41,94.3 C40.33
  Bottom 0.381: v178.44,94.62 v186.06,94.62 | v166.69,77.15 v166.69,90.49
SDF0
  Bottom 0.381: IC14.11 9.21,-15.88 7.3,-17.78 7.3,-34.92 12.38,-40 A40.6
SDF1
  Bottom 0.381: IC14.12 9.21,-18.41 8.26,-19.37 8.26,-33.34 14.92,-40 A40.8
SDF2
  Top 0.381: IC14.13 11.11,-20.95 13.97,-23.81 13.97,-36.51 17.46,-40 A40.10
SI  (via drill 0.61)
  Top 0.381: v74.61,-20.95 74.61,-24.45 72.39,-26.67 69.85,-26.67 69.22,-27.3 69.22,-28.57 80.01,-39.37 87,-39.37 87.63,-40 87.63,-41.27 88.27,-41.91 94.93,-41.91 95.89,-40.96 B40.32
  Bottom 0.381: v74.61,-20.95 72.07,-18.41 IC18.12
SIF0  (via drill 0.61)
  Top 0.381: v13.02,-33.02 13.02,-25.4 11.11,-23.49 IC14.14
  Bottom 0.381: v13.02,-33.02 20,-40 A40.12
SIF1
  Top 0.381: IC14.3 16.83,-23.49 15.88,-24.45 15.88,-33.34 22.54,-40 A40.14
SIF2  (via drill 0.61)
  Top 0.381: v20.64,-28.26 20.64,-35.56 25.08,-40 A40.16
  Bottom 0.381: v20.64,-28.26 20.64,-22.86 18.73,-20.95 IC14.4
SR0
  Top 0.381: IC14.5 16.83,-18.41 14.92,-20.32 14.92,-35.88 19.05,-40 19.05,-41.27 19.68,-41.91 26.35,-41.91 27.3,-40.96 A40.18
SR1  (via drill 0.61)
  Top 0.381: v21.91,-28.26 21.91,-31.75 30.16,-40 A40.20
  Bottom 0.381: v21.91,-28.26 21.91,-19.05 18.73,-15.88 IC14.6
SR2  (via drill 0.61)
  Top 0.381: v25.72,-26.67 25.72,-28.57 37.47,-40.32 A40.26
  Bottom 0.381: v25.72,-26.67 25.72,-19.68 29.53,-15.88 IC15.11
SR3  (via drill 0.61)
  Top 0.381: v26.67,-27.62 26.67,-27.94 38.1,-39.37 39.05,-39.37 40.01,-40.32 A40.28
  Bottom 0.381: v26.67,-27.62 26.67,-21.27 29.53,-18.41 IC15.12
SR4  (via drill 0.61)
  Top 0.381: v27.62,-26.67 27.62,-27.62 38.42,-38.42 40.64,-38.42 42.55,-40.32 A40.30
  Bottom 0.381: v27.62,-26.67 27.62,-22.86 29.53,-20.95 IC15.13
SR5  (via drill 0.61)
  Top 0.381: v35.88,-22.54 36.83,-21.59 39.37,-21.59 40.96,-23.18 v40.96,-27.94
  Bottom 0.381: v35.88,-22.54 31.75,-22.54 IC15.14 | v40.96,-27.94 40.96,-33.02 47.94,-40 A40.34
SR6  (via drill 0.61)
  Top 0.381: v40.01,-28.89 40.01,-24.45 39.05,-23.49 IC15.3
  Bottom 0.381: v40.01,-28.89 40.01,-34.61 45.4,-40 A40.32
SR7  (via drill 0.61)
  Top 0.381: v44.77,-28.89 44.77,-20 42.55,-17.78 40.96,-17.78 39.05,-19.68 IC15.4 | v47.62,-31.75 54.93,-31.75 v59.37,-36.19
  Bottom 0.381: v44.77,-28.89 v47.62,-31.75 | v59.37,-36.19 63.18,-40 B40.6
SR8  (via drill 0.61)
  Top 0.381: v24.77,-28.26 24.77,-30.48 34.29,-40 34.29,-41.27 34.92,-41.91 53.02,-41.91 54.29,-40.64 56.52,-40.64 57.78,-41.91 64.45,-41.91 65.41,-40.96 B40.8
  Bottom 0.381: v24.77,-28.26 24.77,-18.41 29.21,-13.97 31.75,-13.97 35.24,-17.46 36.83,-17.46 IC15.5
SR9  (via drill 0.61)
  Top 0.381: v46.67,-28.89 v46.67,-22.86 | v54.93,-41.59 57.78,-44.45 66.67,-44.45 67.31,-43.81 67.31,-42.23 68.26,-41.27 B40.10
  Bottom 0.381: v46.67,-22.86 39.37,-15.56 IC15.6 | v46.67,-28.89 54.93,-37.15 v54.93,-41.59
SR10  (via drill 0.61)
  Top 0.381: v45.72,-26.67 45.72,-20 49.85,-15.88 IC16.11 | v47.62,-33.34 54.93,-33.34 v57.47,-35.88
  Bottom 0.381: v45.72,-26.67 44.45,-27.94 44.13,-27.94 43.81,-28.26 43.81,-29.53 v47.62,-33.34 | v57.47,-35.88 58.1,-35.88 58.74,-35.24 65.09,-35.24 70.48,-40.64 B40.12
SR11  (via drill 0.61)
  Top 0.381: v56.2,-22.86 56.2,-25.72 57.15,-26.67 59.69,-26.67 61.59,-28.57 61.59,-30.48 v62.23,-31.11
  Bottom 0.381: v56.2,-22.86 51.75,-18.41 IC16.12 | v62.23,-31.11 70.48,-39.37 72.07,-39.37 73.03,-40.32 B40.14
SS  (via drill 0.61)
  Top 0.381: v84.45,-24.13 v81.92,-21.59
  Bottom 0.381: v81.92,-21.59 77.47,-21.59 76.83,-20.95 76.83,-20.64 72.07,-15.88 IC18.11 | v84.45,-24.13 96.84,-24.13 98.74,-26.03 98.74,-40 B40.34
START  (via drill 0.61)
  Top 0.381: v60.64,-32.7 v53.66,-25.72 | v63.82,-34.29 69.53,-34.29 75.56,-40.32 B40.16
  Bottom 0.381: v53.66,-25.72 54.29,-25.72 54.93,-25.08 54.93,-23.49 52.07,-20.64 IC16.13 | v60.64,-32.7 62.23,-32.7 v63.82,-34.29
STOP
  Top 0.381: IC16.6 59.69,-14.92 62.55,-14.92 73.98,-3.49 105.41,-3.49 107.95,-6.03 107.95,-27.3 94.61,-40.64 B40.30
TAD
  Bottom 0.381: IC10.5 300.04,102.87 300.04,101.92 309.25,92.71 310.51,92.71 311.79,91.44 D40.4
VCC  (via drill 0.61)  (2 unrouted)
  Top 0.762: 50.8,114.62 27.94,114.62 26.04,112.71 IC1.16 | 50.8,114.62 52.7,112.71 IC2.16 | 79.69,112.71 72.71,112.71 70.8,114.62 51.12,114.62 50.8,114.62 | 79.69,112.71 80.64,112.71 IC3.16 | 79.69,112.71 79.69,113.03 79.69,114.94 80.33,115.57 108.27,115.57 111.12,112.71 IC4.16 112.39,112.71 114.3,114.62 139.7,114.62 141.6,112.71 IC5.16 142.88,112.71 145.73,115.57 169.23,115.57 172.09,112.71 IC6.16 173.04,113.03 173.04,113.67 174.94,115.57 206.38,115.57 206.53,115.41 | VCC2.1 362.58,82.23 361.63,82.23 VCC1.1 356.55,87.31 356.55,90.49 343.85,103.19 343.85,109.22 345.12,110.49 IC12.16 | 206.53,115.41 206.69,115.57 230.19,115.57 233.04,112.71 IC8.16 234.31,112.71 237.17,115.57 258.13,115.57 260.99,112.71 IC9.16 262.25,112.71 264.48,114.94 286.7,114.94 | 206.53,115.41 203.84,112.71 IC7.16 | 286.7,114.94 288.93,112.71 IC10.16 | IC11.16 316.87,112.71 308.93,112.71 306.7,114.94 287.02,114.94 286.7,114.94 | v54.93,46.04 43.5,57.47 34.29,57.47 28.57,51.75 IC13.16 27.62,49.53 25.4,47.31 25.4,38.74 C1.1 25.4,37.47 11.75,23.81 11.75,18.73 VCC3.1 | IC18.16 72.39,-28.26 74.93,-28.26 76.83,-30.16 84.14,-30.16 86.04,-28.26 R6.1 86.36,-27.3 86.36,-26.03 R7.1 86.36,-24.77 86.36,-23.49 R8.1 86.36,-22.22 86.36,-20.95 R9.1 86.36,-19.68 86.36,-18.41 R10.1 | IC16.16 49.53,-28.26 47.62,-30.16 33.66,-30.16 31.75,-28.26 IC15.16
  Bottom 0.762: IC11.16 318.13,112.71 320.04,114.62 342.9,114.62 344.81,112.71 IC12.16 | v54.93,46.04 139.06,46.04 J2.2 | IC14.16 11.43,-28.26 15.56,-28.26 17.46,-30.16 27.3,-30.16 29.21,-28.26 IC15.16 | 56.2,-29.53 53.34,-29.53 52.07,-28.26 IC16.16 | 56.2,-29.53 60.64,-29.53 61.91,-28.26 69.85,-28.26 IC18.16 | VCC4.1 70.17,-51.75 64.77,-51.75 56.2,-43.18 56.2,-29.84 56.2,-29.53
VDD  (via drill 0.61)
  Top 0.762: v79.69,20 70.8,28.89 70.8,29.21 J4.4
  Bottom 0.762: v79.69,20 87.31,20 91.76,15.56 93.34,15.56 3.3V.2
VSS
  Top 0.762: J4.6 75.56,30.16 74.61,31.12 67.63,31.12 67.31,30.8 67.31,30.16 J4.3 66.99,29.21 56.2,18.42 56.2,13.34 J3.1
WC
  Bottom 0.381: IC11.7 333.06,102.87 333.06,101.92 339.73,95.25 343.54,95.25 344.17,94.62 344.17,93.03 345.12,92.08 D40.30